# EAGLE design bus_power (EAGLE 6.2)
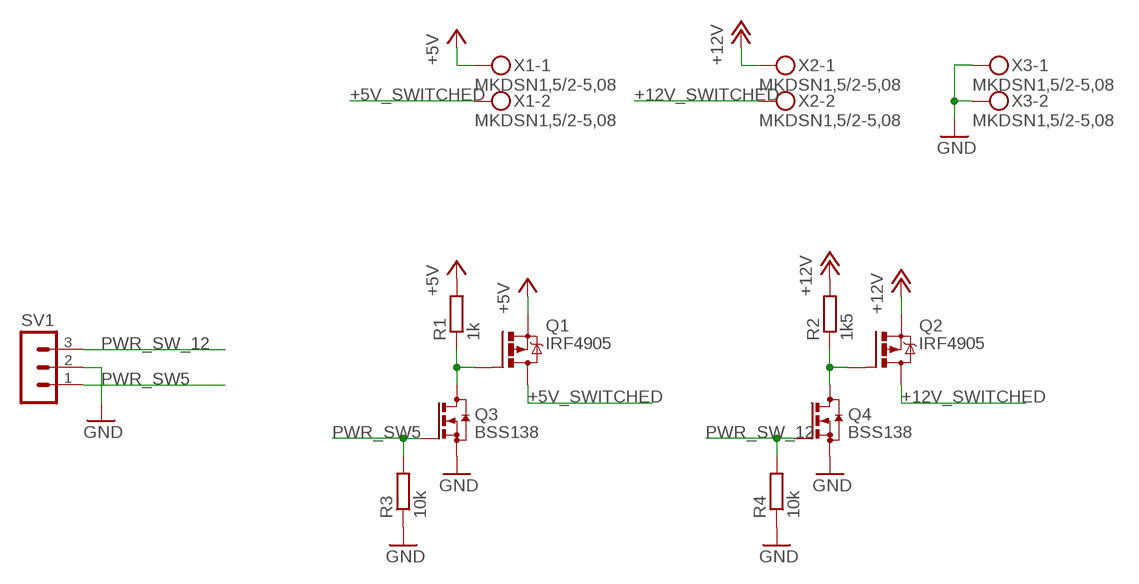
[diagram p0: schematic, sheet 1]

## Parts
Q1  IRF4905  IRF9530  [TO220BV]
Q2  IRF4905  IRF9530  [TO220BV]
Q3  BSS138  BSS123  [SOT23]
Q4  BSS138  BSS123  [SOT23]
R1  1k  R-EU_R0805  [R0805]
R2  1k5  R-EU_R0805  [R0805]
R3  10k  R-EU_R0805  [R0805]
R4  10k  R-EU_R0805  [R0805]
SV1  MA03-1  [MA03-1]
X1  MKDSN1,5/2-5,08  [MKDSN1,5/2-5,08]
X2  MKDSN1,5/2-5,08  [MKDSN1,5/2-5,08]
X3  MKDSN1,5/2-5,08  [MKDSN1,5/2-5,08]

## Nets
+5V: Q1.S R1.2 X1.1
+5V_SWITCHED: Q1.D X1.2
+12V: Q2.S R2.2 X2.1
+12V_SWITCHED: Q2.D X2.2
G5: Q1.G Q3.3(D) R1.1
G12: Q2.G Q4.3(D) R2.1
GND: Q3.2(S) Q4.2(S) R3.1 R4.1 SV1.2 X3.1 X3.2
PWR_SW5: Q3.1(G) R3.2 SV1.1
PWR_SW_12: Q4.1(G) R4.2 SV1.3

## Library data of the parts
Q1 Q2 = transistor-power:IRF9530: P-CHANNEL HEXFET POWER-MOS-FET Source: http://www.irf.com/product-info/datasheets/data/irf9530.pdf
Q3 Q4 = transistor-small-signal:BSS123: N-CHANNEL MOS FET
R1-R4 = rcl:R-EU_: RESISTOR, European symbol
SV1 = con-lstb:MA03-1: PIN HEADER; OC_FARNELL: unknown; OC_NEWARK: unknown
X1-X3 = con-phoenix-508:MKDSN1,5/2-5,08: MKDSN 1,5/ 2-5,08 Printklemme Nennstrom: 13,5 A Nennspannung: 250 V Rastermaß: 5,08 mm Polzahl: 2 Anschlussart: Schraubanschluss Montage: Löten Anschlussrichtung Leiter/Platine: 0 ° Artikelnummer: 1729128 Source: http://eshop.phoenixcontact.com .. 1729128.pdf; MPN: MKDSN 1,5/2-5.08; OC_FARNELL: 1792903; OC_NEWARK: 30M2397

## Board
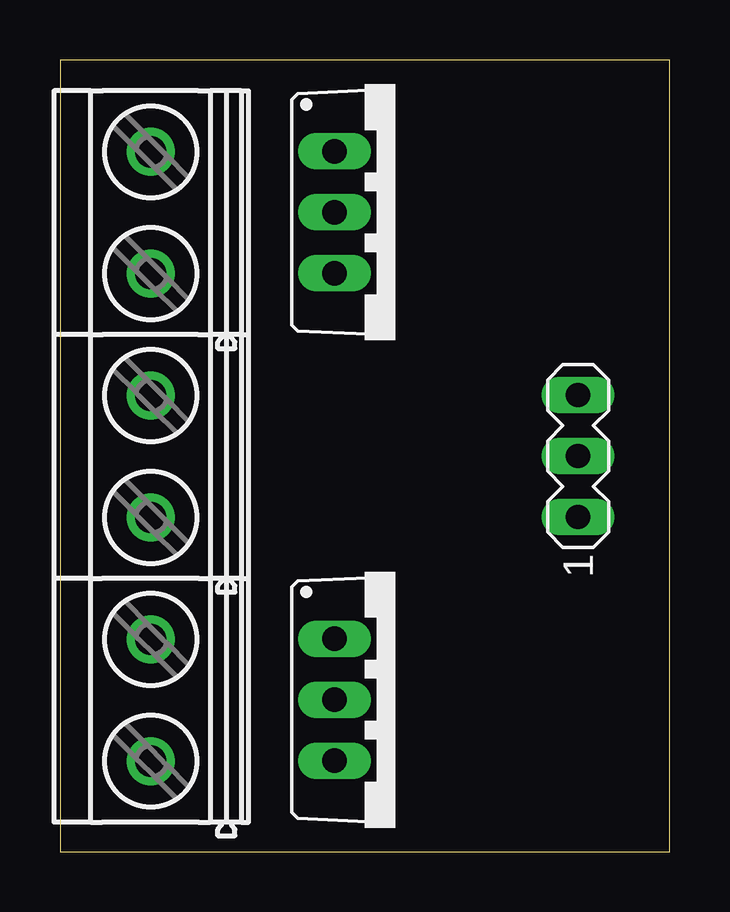
[diagram p1: board, top side]
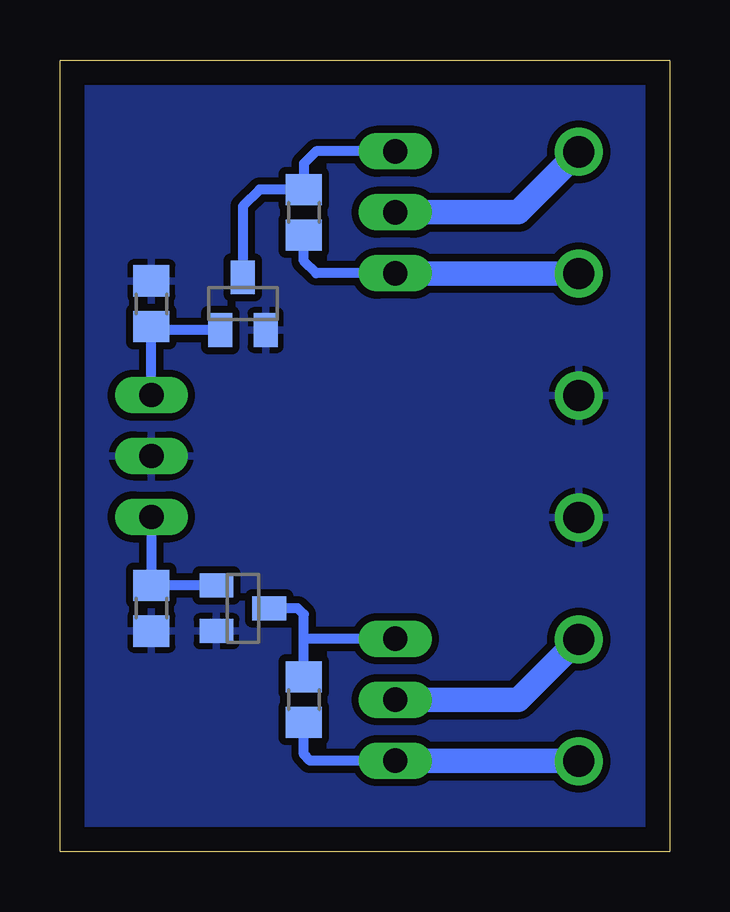
[diagram p2: board, bottom side, seen from below]

Size 25.4 x 33.02 mm. Coordinates in mm from the lower left corner, seen from the top.
Outline: 0,0 25.4,0 25.4,33.02 0,33.02 0,0
Copper layers (1*16): Top 0.035mm / dielectric 1.5mm / Bottom 0.035mm
Design rules: minimum track width 10mil, minimum drill 24mil, track to track 8mil, track to pad 8mil, pad to pad 8mil, via to via 8mil, smd to smd 8mil, copper to edge 40mil, drill to drill 8mil, minimum pad ring 10mil, minimum via ring 8mil, stop-mask expansion 4mil, vias tented up to drill 0mil, thermal gap 10mil

### Footprints (pad centres in the part's own frame; a part is rotated, then mirrored left to right if it is on the bottom)
TO220BV = drill 1.016 long: D 0,-2.54; G -2.54,-2.54; S 2.54,-2.54
SOT23 = smd 1 x 1.4: 1 -0.95,-1.1; 2 0.95,-1.1; 3 0,1.1
R0805 = smd 1.3 x 1.5: 1 -0.95,0; 2 0.95,0
MA03-1 = drill 1.016 long: 1 -2.54,0; 2 0,0; 3 2.54,0
MKDSN1,5/2-5,08 = drill 1.3 pad 2: 1 -2.561,0.025; 2 2.519,0.025

### Placement (x,y rotation side)
Q1  13.97,6.35 270 top
Q2  13.97,26.67 270 top
Q3  17.78,10.16 270 bottom
Q4  17.78,22.86 0 bottom
R1  15.24,6.35 270 bottom
R2  15.24,26.67 270 bottom
R3  21.59,10.16 90 bottom
R4  21.59,22.86 270 bottom
SV1  21.59,16.51 90 top
X1  3.81,6.35 90 top
X2  3.81,26.67 90 top
X3  3.81,16.51 90 top

### Tracks (layer width: path | path; a pad name or v marks a point on that pad's centre or on a via)
+5V
  Bottom 0.406: Q1.S 14.99,3.81 15.24,4.06 R1.2
  Bottom 0.61: 3.81,3.81 X1.1
  Bottom 1.016: Q1.S 3.81,3.81
+5V_SWITCHED
  Bottom 1.016: Q1.D 6.3,6.35 X1.2
+12V
  Bottom 0.406: Q2.S 14.73,24.13 15.24,24.64 R2.2
  Bottom 0.61: 11.41,24.11 Q2.S
  Bottom 1.016: X2.1 11.41,24.11
+12V_SWITCHED
  Bottom 1.016: Q2.D 6.3,26.67 X2.2
G5
  Bottom 0.406: Q1.G 15.24,8.89 | R1.1 15.24,8.89 | 15.24,8.89 15.24,9.91 15.49,10.16 Q3.3
G12
  Bottom 0.406: Q2.G 14.73,29.21 15.24,28.7 R2.1 17.08,27.62 17.78,26.92 Q4.3
GND
  pour Bottom (isolate 0.305): -1.27,34.29 26.67,34.29 26.67,-1.27 -1.27,-1.27
PWR_SW5
  Bottom 0.406: Q3.1 R3.2 SV1.1
PWR_SW_12
  Bottom 0.406: SV1.3 R4.2 21.59,21.76 Q4.1